# Altium schematic sheet LogicAnalyser.SchDoc
size A; Organization: Altium Limited; Address1: L3, 12a Rodborough Rd; Address2: Frenchs Forest; Address3: NSW; Address4: Australia 2086; DocumentNumber: 2; SheetNumber: 2; SheetTotal: 3
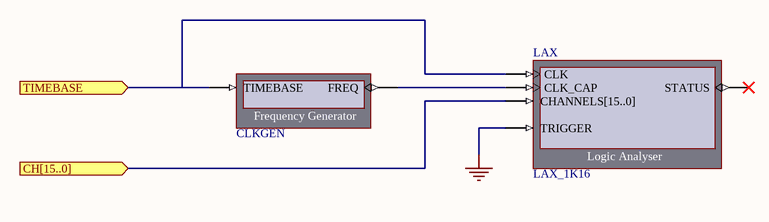
[diagram p0: LogicAnalyser.SchDoc]

## Parts
LAX  LAX_1K16
LAXCLK  CLKGEN

## Ports
CH[15..0] (in), TIMEBASE (in)

## Nets
GND: LAX.TRIGGER
CH[15..0]: LAX.CHANNELS[15..0] ; port CH[15..0]
TIMEBASE: LAX.CLK LAXCLK.TIMEBASE ; port TIMEBASE
NetLAX_CLK_CAP: LAX.CLK_CAP LAXCLK.FREQ

Not connected (* = marked no-connect by the designer): LAX STATUS*

## Notes on the sheet
- Title
- Size:
- Date:
- A
- Number:
- Time:
- Revision:
- Sheet
- of
- File:
- (in symbol LAX_1K16) Logic Analyser

## Library data of the parts
LAX = LAX_1K16: Logic Analyser 1K16; NEXUS_CORE: Instrument; NEXUS_JTAG_DEVICE: True; NEXUS_JTAG_ORDER: 20; ChildModel1: RAM1KX16_LA16_1K; Published: 24/11/2003; Publisher: Altium Hobart Technology Centre; Core Revision: 1.00.00
LAXCLK = CLKGEN: Frequency Generator; NEXUS_CORE: Instrument; NEXUS_JTAG_DEVICE: True; NEXUS_JTAG_ORDER: 10; Published: 30/09/2003; Publisher: Altium Hobart Technology Centre; Core Revision: 1.00.00